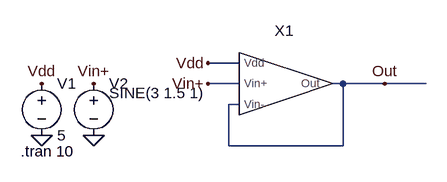
[diagram p0: schematic unity_fb.asc]
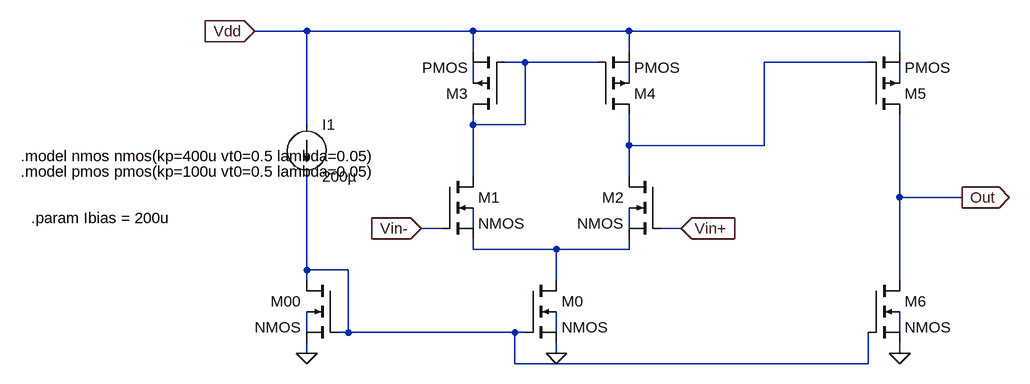
[diagram p1: sub-circuit 2stageopampdesign_v02.asc]
unity_fb.asc, the LTspice schematic file:
Version 4
SHEET 1 880 680
WIRE 240 144 192 144
WIRE 240 176 192 176
WIRE 400 176 384 176
WIRE 464 176 400 176
WIRE 528 176 464 176
WIRE 240 208 224 208
WIRE 224 272 224 208
WIRE 400 272 400 176
WIRE 400 272 224 272
FLAG -64 256 0
FLAG 16 256 0
FLAG -64 176 Vdd
FLAG 192 144 Vdd
FLAG 16 176 Vin+
FLAG 192 176 Vin+
FLAG 464 176 Out
SYMBOL 2stageopampdesign_v02 304 176 R0
SYMATTR InstName X1
SYMBOL voltage -64 160 R0
WINDOW 123 0 0 Left 0
WINDOW 39 0 0 Left 0
SYMATTR InstName V1
SYMATTR Value 5
SYMBOL voltage 16 160 R0
WINDOW 3 24 30 Left 2
WINDOW 123 0 0 Left 0
WINDOW 39 0 0 Left 0
SYMATTR InstName V2
SYMATTR Value SINE(3 1.5 1)
TEXT -96 280 Left 2 !.tran 10

2stageopampdesign_v02.asc, the sub-circuit schematic file:
Version 4
SHEET 1 932 680
WIRE -128 16 -208 16
WIRE 128 16 -128 16
WIRE 368 16 128 16
WIRE 784 16 368 16
WIRE 128 48 128 16
WIRE 368 48 368 16
WIRE 784 48 784 16
WIRE 208 64 176 64
WIRE 320 64 208 64
WIRE 736 64 576 64
WIRE 128 96 128 64
WIRE 368 96 368 64
WIRE 784 96 784 64
WIRE -128 160 -128 16
WIRE 128 160 128 144
WIRE 208 160 208 64
WIRE 208 160 128 160
WIRE 368 192 368 144
WIRE 576 192 576 64
WIRE 576 192 368 192
WIRE 128 240 128 160
WIRE 368 240 368 192
WIRE 784 272 784 144
WIRE 880 272 784 272
WIRE 80 320 48 320
WIRE 128 320 128 288
WIRE 368 320 368 288
WIRE 448 320 416 320
WIRE 128 352 128 336
WIRE 256 352 128 352
WIRE 368 352 368 336
WIRE 368 352 256 352
WIRE -128 384 -128 240
WIRE -64 384 -128 384
WIRE -128 400 -128 384
WIRE 256 400 256 352
WIRE 784 400 784 272
WIRE -128 480 -128 448
WIRE -64 480 -64 384
WIRE -64 480 -80 480
WIRE 192 480 -64 480
WIRE 208 480 192 480
WIRE 256 480 256 448
WIRE 784 480 784 448
WIRE -128 512 -128 496
WIRE 256 512 256 496
WIRE 784 512 784 496
WIRE 192 528 192 480
WIRE 736 528 736 480
WIRE 736 528 192 528
FLAG -128 512 0
FLAG 256 512 0
FLAG -208 16 Vdd
IOPIN -208 16 In
FLAG 48 320 Vin-
IOPIN 48 320 In
FLAG 448 320 Vin+
IOPIN 448 320 In
FLAG 784 512 0
FLAG 880 272 Out
IOPIN 880 272 Out
SYMBOL current -128 160 R0
WINDOW 123 0 0 Left 0
WINDOW 39 0 0 Left 0
SYMATTR InstName I1
SYMATTR Value 200µ
SYMBOL nmos4 -80 400 M0
SYMATTR InstName M00
SYMATTR Value2 l=1 w=4
SYMBOL pmos4 176 144 R180
SYMATTR InstName M3
SYMATTR Value2 l=1 w=64
SYMBOL pmos4 320 144 M180
SYMATTR InstName M4
SYMATTR Value2 l=1 w=64
SYMBOL nmos4 208 400 R0
SYMATTR InstName M0
SYMATTR Value2 l=1 w=32
SYMBOL nmos4 80 240 R0
SYMATTR InstName M1
SYMATTR Value2 l=1 w=16
SYMBOL nmos4 416 240 M0
SYMATTR InstName M2
SYMATTR Value2 l=1 w=16
SYMBOL nmos4 736 400 R0
SYMATTR InstName M6
SYMATTR Value2 l=1 w=160
SYMBOL pmos4 736 144 M180
SYMATTR InstName M5
SYMATTR Value2 l=1 w=640
TEXT -552 304 Left 2 !.param Ibias = 200u
TEXT -568 208 Left 2 !.model nmos nmos(kp=400u vt0=0.5 lambda=0.05)
TEXT -568 232 Left 2 !.model pmos pmos(kp=100u vt0=0.5 lambda=0.05)

The netlist it stands for:
* unity_fb.asc
XX1 Vdd Vin+ Out Out 2stageopampdesign_v02
V1 Vdd 0 5
V2 Vin+ 0 SINE(3 1.5 1)

* block symbol definitions
.subckt 2stageopampdesign_v02 Vdd Vin+ Vin- Out
I1 Vdd N009 200µ
M00 N009 N009 0 N010 NMOS l=1 w=4
M3 N001 N001 Vdd N003 PMOS l=1 w=64
M4 N002 N001 Vdd N004 PMOS l=1 w=64
M0 N008 N009 0 N011 NMOS l=1 w=32
M1 N001 Vin- N008 N006 NMOS l=1 w=16
M2 N002 Vin+ N008 N007 NMOS l=1 w=16
M6 Out N009 0 N012 NMOS l=1 w=160
M5 Out N002 Vdd N005 PMOS l=1 w=640
.param Ibias = 200u
.model nmos nmos(kp=400u vt0=0.5 lambda=0.05)
.model pmos pmos(kp=100u vt0=0.5 lambda=0.05)
.ends 2stageopampdesign_v02

.model NMOS NMOS
.model PMOS PMOS
.lib standard.mos
.tran 10
.backanno
.end